# EAGLE design space_elevator (EAGLE 7.1.0)
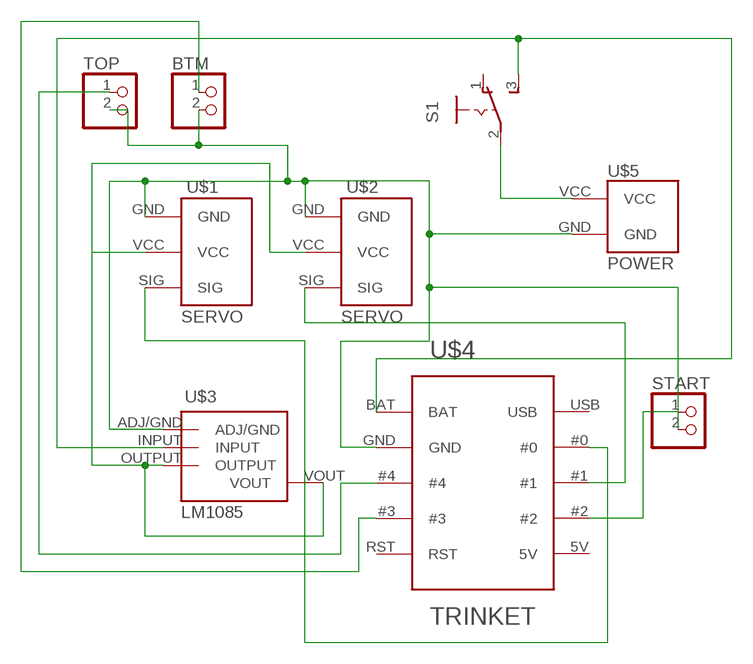
[diagram p0: schematic, sheet 1]

## Parts
BTM  PINHD-1X2  [1X02]
S1  255SB  [255SB]
START  PINHD-1X2  [1X02]
TOP  PINHD-1X2  [1X02]
U$1  SERVO  [SERVO]
U$2  SERVO  [SERVO]
U$3  LM1085  [TO220H]
U$4  TRINKET  [TRINKETUSB]
U$5  POWER  [POWER]

## Nets
GND: BTM.2 START.2 TOP.2 U$1.GND U$2.GND U$3.ADJ/GND U$4.GND U$5.GND
N$1: S1.2(P) U$5.VCC
N$2: S1.3(S) U$3.INPUT U$4.BAT
N$3: U$1.VCC U$2.VCC U$3.OUTPUT U$3.VOUT
N$5: TOP.1 U$4.#4
N$6: BTM.1 U$4.#3
N$8: START.1 U$4.#2
N$9: U$2.SIG U$4.#1
N$10: U$1.SIG U$4.#0
Unconnected: S1.1(O) U$4.5V U$4.RST U$4.USB

## Library data of the parts
BTM START TOP = pinhead:PINHD-1X2: PIN HEADER
S1 = switch:255SB: SLIDING SWITCH Distributor Buerklin, 11G810
U$1 U$2 = gabe:SERVO
U$3 = gabe:LM1085
U$4 = gabe:TRINKET
U$5 = gabe:POWER

## Board
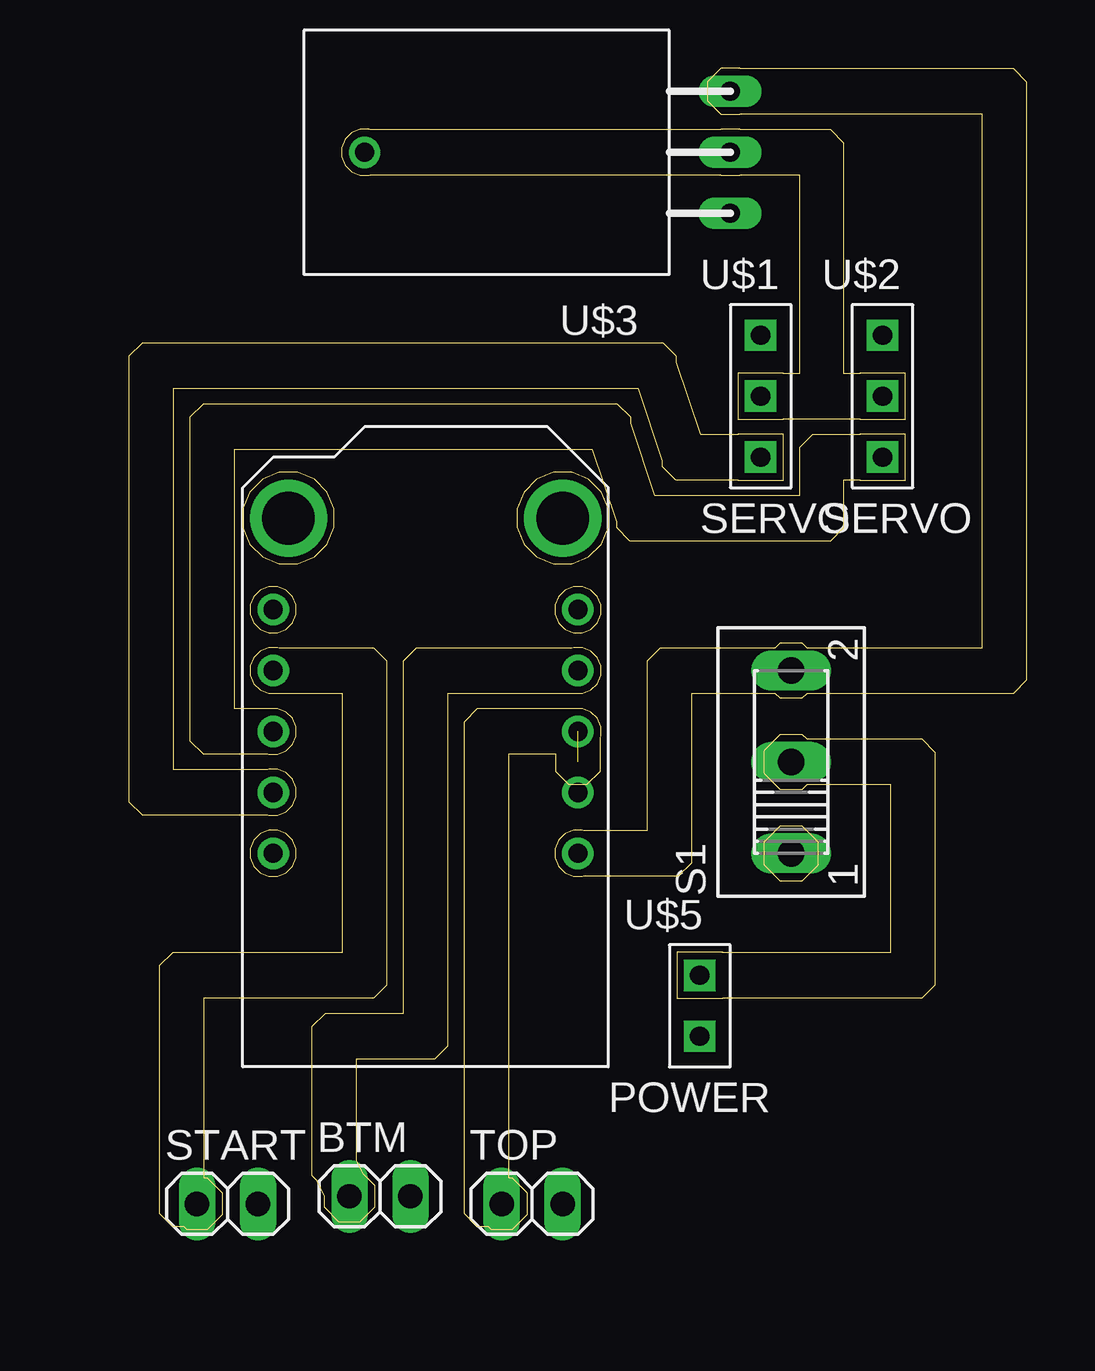
[diagram p1: board, top side]
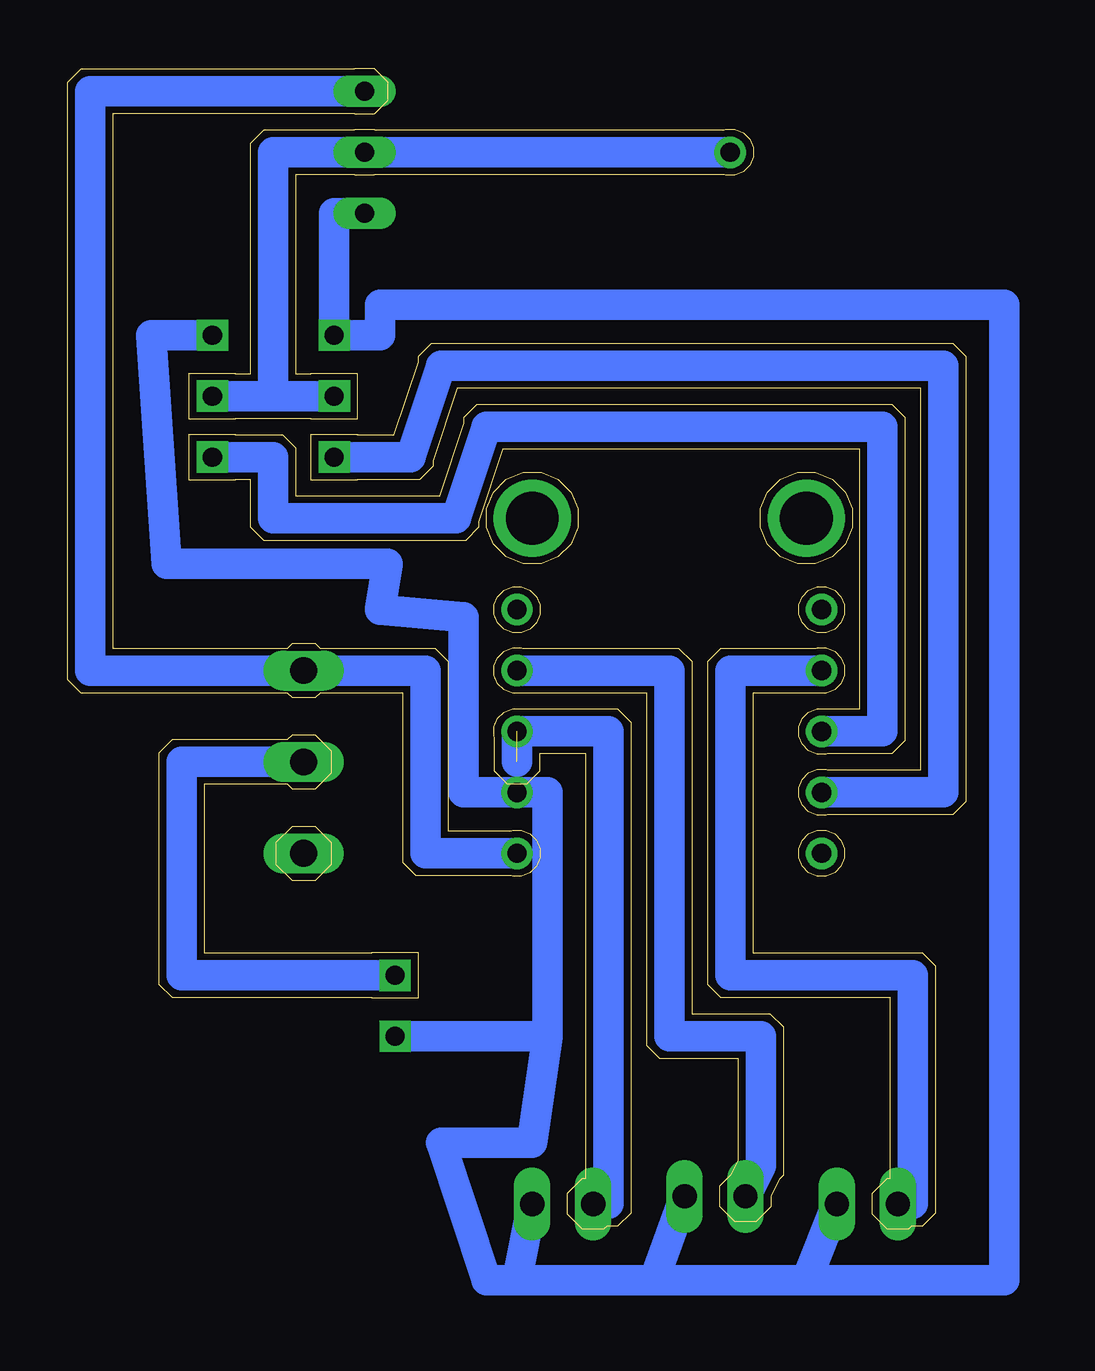
[diagram p2: board, bottom side, seen from below]

No outline drawn. Coordinates in mm, seen from the top.
Copper layers (1*16): Top 0.035mm / dielectric 1.5mm / Bottom 0.035mm
Design rules "default": minimum track width 10mil, minimum drill 24mil, track to track 8mil, track to pad 8mil, pad to pad 8mil, via to via 8mil, smd to smd 8mil, copper to edge 40mil, drill to drill 8mil, minimum pad ring 10mil, minimum via ring 8mil, stop-mask expansion 4mil, vias tented up to drill 0mil, thermal gap 10mil
Milling: 341 lines

### Footprints (pad centres in the part's own frame; a part is rotated, then mirrored left to right if it is on the bottom)
1X02 = drill 1.016 long: 1 -1.27,0; 2 1.27,0
255SB = drill 1.118 long: 1 -3.81,0; 2 0,0; 3 3.81,0
SERVO = drill 0.8 square: GND 0,2.54; SIG 0,-2.54; VCC 0,0
TO220H = drill 0.8 long: ADJ/GND -2.54,-2.54; INPUT 2.54,-2.54; OUTPUT 0,-2.54 | drill 0.8: VOUT 0,12.7
TRINKETUSB = drill 0.8: 5V 7.62,-1.27; #0 7.62,6.35; #1 7.62,3.81; #2 7.62,1.27; #3 -5.08,1.27; #4 -5.08,3.81; BAT -5.08,8.89; GND -5.08,6.35; RST -5.08,-1.27; USB 7.62,8.89 | drill 2.2: P$11 -4.445,-5.08; P$12 6.985,-5.08
POWER = drill 0.8 square: GND 0,0; VCC 0,2.54

### Placement (x,y rotation side)
BTM  16.51,2.86 0 top
S1  33.66,20.95 90 top
START  10.16,2.54 0 top
TOP  22.86,2.54 0 top
U$1  32.38,36.2 0 top
U$2  37.47,36.2 0 top
U$3  28.57,46.35 90 top
U$4  19.68,26.04 180 top
U$5  29.84,9.53 0 top

### Tracks (layer width: path | path; a pad name or v marks a point on that pad's centre or on a via)
GND
  Bottom 1.27: U$2.GND 40.01,38.73 39.37,29.21 30.16,29.21 30.48,27.3 26.99,26.99 26.99,19.68 U$4.GND 23.5,19.68 23.5,9.53 | 23.5,9.53 U$5.GND | 12.7,-0.64 4.45,-0.64 4.45,40.01 30.48,40.01 30.48,38.73 U$1.GND 32.38,43.81 U$3.ADJ/GND | 12.7,-0.64 19.05,-0.64 | 19.05,-0.64 24.77,-0.64 | 24.77,-0.64 26.04,-0.64 27.94,5.08 24.13,5.08 23.5,9.53 | TOP.2 24.77,-0.64 | BTM.2 19.05,-0.64 | START.2 12.7,-0.64
N$1
  Bottom 1.27: S1.2 38.73,20.95 38.73,12.06 U$5.VCC
N$2
  Bottom 1.27: U$4.BAT 28.57,17.14 28.57,24.77 S1.3 42.55,24.77 42.55,48.9 U$3.INPUT
N$3
  Bottom 1.27: 34.92,36.2 34.92,46.35 U$3.OUTPUT U$3.VOUT | 34.92,36.2 U$2.VCC | U$1.VCC 34.92,36.2
N$5  (1 unrouted)
  Bottom 1.27: TOP.1 20.95,2.54 20.95,22.23 U$4.#4 24.77,20.95
N$6
  Bottom 1.27: BTM.1 14.61,4.13 14.61,9.53 18.41,9.53 18.41,24.77 U$4.#3
N$8
  Bottom 1.27: START.1 8.26,2.54 8.26,12.06 15.88,12.06 15.88,24.77 U$4.#2
N$9
  Bottom 1.27: U$2.SIG 34.92,33.66 34.92,31.11 27.3,31.11 26.04,34.92 9.53,34.92 9.53,22.23 U$4.#1
N$10
  Bottom 1.27: U$1.SIG 29.21,33.66 27.94,37.47 6.99,37.47 6.99,19.68 U$4.#0